# EAGLE design v0 (EAGLE 9.0.1)
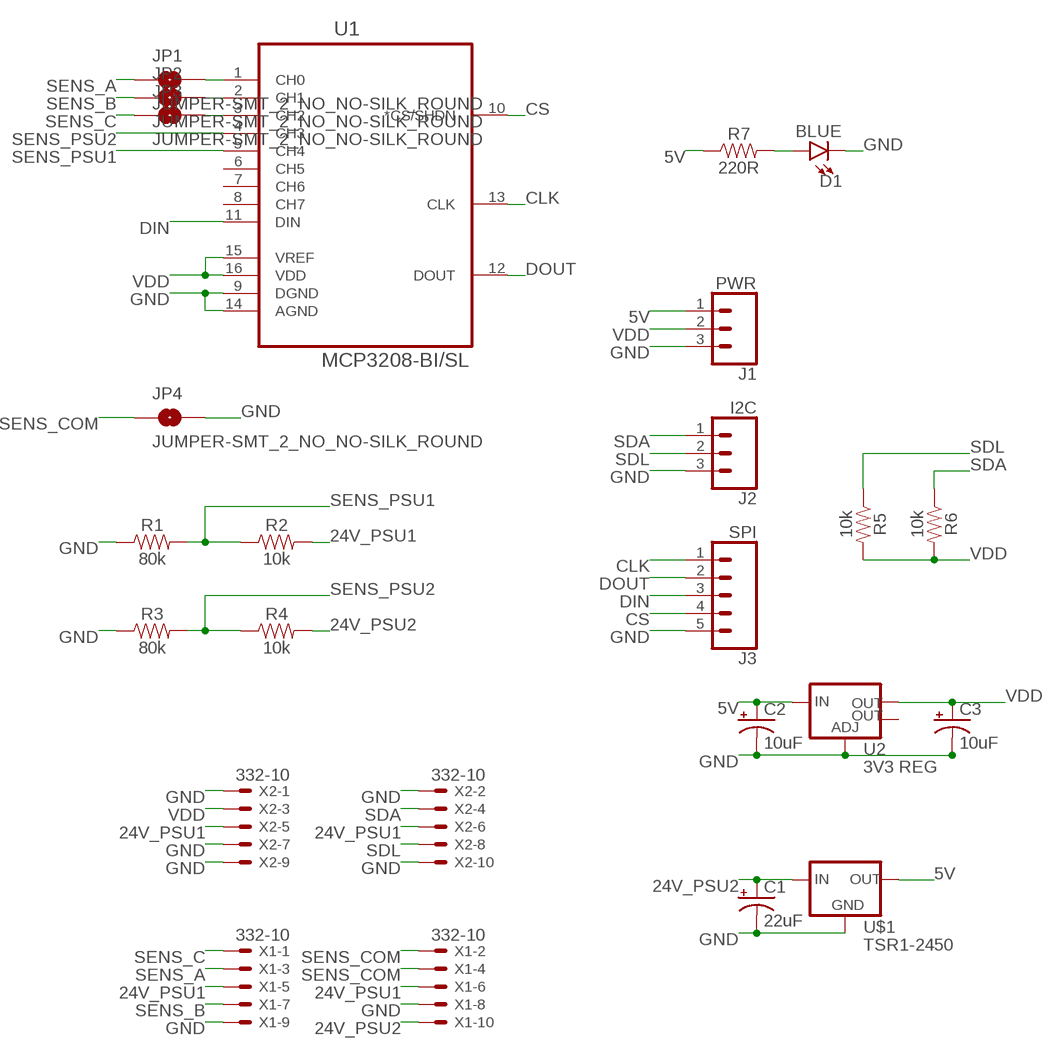
[diagram p0: schematic, sheet 1]

## Parts
C1  22uF  10UF-POLAR-EIA3216-16V-10%(TANT)  [EIA3216]
C2  10uF  10UF-POLAR-EIA3216-16V-10%(TANT)  [EIA3216]
C3  10uF  10UF-POLAR-EIA3216-16V-10%(TANT)  [EIA3216]
D1  BLUE  LED-BLUE0603  [LED-0603]
J1  PWR  CONN_03  [1X03]
J2  I2C  CONN_03  [1X03]
J3  SPI  CONN_05  [1X05]
JP1  JUMPER-SMT_2_NO_NO-SILK_ROUND  [SMT-JUMPER_2_NO_NO-SILK_ROUND]
JP2  JUMPER-SMT_2_NO_NO-SILK_ROUND  [SMT-JUMPER_2_NO_NO-SILK_ROUND]
JP3  JUMPER-SMT_2_NO_NO-SILK_ROUND  [SMT-JUMPER_2_NO_NO-SILK_ROUND]
JP4  JUMPER-SMT_2_NO_NO-SILK_ROUND  [SMT-JUMPER_2_NO_NO-SILK_ROUND]
R1  80k  RESISTOR0805  [0805]
R2  10k  RESISTOR0805  [0805]
R3  80k  RESISTOR0805  [0805]
R4  10k  RESISTOR0805  [0805]
R5  10k  RESISTOR0805  [0805]
R6  10k  RESISTOR0805  [0805]
R7  220R  RESISTOR0805  [0805]
U1  MCP3208-BI/SL  [SOIC127P600X175-16N]
U2  3V3 REG  V_REG_LM1117SOT223  [SOT223]
U$1  TSR1-2450  [TSR1-2450]
X1  332-10  [332-10]
X2  332-10  [332-10]

## Nets
5V: C2.+ J1.1 R7.1 U2.3(IN) U$1.3(OUT)
24V_PSU1: R2.2 X1.5 X1.6 X2.5 X2.6
24V_PSU2: C1.+ R4.2 U$1.1(IN) X1.10
CLK: J3.1 U1.13(CLK)
CS: J3.4 U1.10(*CS/SHDN)
DIN: J3.3 U1.11(DIN)
DOUT: J3.2 U1.12(DOUT)
GND: C1.- C2.- C3.- D1.C J1.3 J2.3 J3.5 JP4.2 R1.1 R3.1 U1.9(DGND) U1.14(AGND) U2.1(ADJ) U$1.2(GND) X1.8 X1.9 X2.1 X2.2 X2.7 X2.9 X2.10
N$1: JP1.2 U1.1(CH0)
N$2: JP2.2 U1.2(CH1)
N$3: JP3.2 U1.3(CH2)
N$4: D1.A R7.2
SDA: J2.1 R6.1 X2.4
SDL: J2.2 R5.1 X2.8
SENS_A: JP1.1 X1.3
SENS_B: JP2.1 X1.7
SENS_C: JP3.1 X1.1
SENS_COM: JP4.1 X1.2 X1.4
SENS_PSU1: R1.2 R2.1 U1.5(CH4)
SENS_PSU2: R3.2 R4.1 U1.4(CH3)
VDD: C3.+ J1.2 R5.2 R6.2 U1.15(VREF) U1.16(VDD) U2.2(OUT) X2.3
Unconnected: U1.6(CH5) U1.7(CH6) U1.8(CH7) U2.4(OUT)

## Library data of the parts
C1 = SparkFun-Capacitors:10UF-POLAR: 10.0µF polarized capacitors A capacitor is a passive two-terminal electrical component used to store electrical energy temporarily in an electric field.; PROD_ID: CAP-00811; VALUE: 10uF
C2 C3 = SparkFun-Capacitors:10UF-POLAR: 10.0µF polarized capacitors A capacitor is a passive two-terminal electrical component used to store electrical energy temporarily in an electric field.; PROD_ID: CAP-00811
D1 = SparkFun-LED:LED-BLUE: Blue SMD LED Used in manufacturing of various products at SparkFun Packages: 0603 - SMD 0603 package [Product Link] <http://www.digikey.com/product-detail/en/SMLE12BC7TT86/511-1589-2-ND/1641808> 1206 - SMD1206 package [Product Link] <http://www.digikey.com/product-detail/en/lite-on-inc/LTST-C150TBKT/160-1643-1-ND/573584> SparkFun Products: ESP8266 Thing-Dev Board <https://www.sparkfun.com/products/13711> RedBoard <https://www.sparkfun.com/products/12757>; PROD_ID: DIO-08575
J1 J2 = SparkFun-Connectors:CONN_03: Multi connection point. Often used as Generic Header-pin footprint for 0.1 inch spaced/style header connections On any of the 0.1 inch spaced packages, you can populate with these: Break Away Headers - Straight <https://www.sparkfun.com/products/116> (PRT-00116) Break Away Male Headers - Right Angle <https://www.sparkfun.com/products/553> (PRT-00553) Female Headers <https://www.sparkfun.com/products/115> (PRT-00115) Break Away Headers - Machine Pin <https://www.sparkfun.com/products/117> (PRT-00117) Break Away Female Headers - Swiss Machine Pin <https://www.sparkfun.com/products/743> (PRT-00743) Stackable Header - 3 Pin (Female, 0.1") <https://www.sparkfun.com/products/13875> (PRT-13875) For SCREWTERMINALS and SPRING TERMINALS visit here: Screw Terimnals on SparkFun.com <https://www.sparkfun.com/search/results?term=Screw+Terminals> (5mm/3.5mm/2.54mm spacing) This device is also useful as a general connection point to wire up your design to another part of your project. Our various solder wires solder well into these plated through hole pads. Hook-Up Wire - Assortment (Stranded, 22 AWG) <https://www.sparkfun.com/products/11375> (PRT-11375) Hook-Up Wire - Assortment (Solid Core, 22 AWG) <https://www.sparkfun.com/products/11367> (PRT-11367) View the entire wire category on our website here <https://www.sparkfun.com/categories/141> Special notes: Molex polarized connector foot print use with SKU : PRT-08232 with associated crimp pins and housings.
J3 = SparkFun-Connectors:CONN_05: Multi connection point. Often used as Generic Header-pin footprint for 0.1 inch spaced/style header connections On any of the 0.1 inch spaced packages, you can populate with these: Break Away Headers - Straight <https://www.sparkfun.com/products/116> (PRT-00116) Break Away Male Headers - Right Angle <https://www.sparkfun.com/products/553> (PRT-00553) Female Headers <https://www.sparkfun.com/products/115> (PRT-00115) Break Away Headers - Machine Pin <https://www.sparkfun.com/products/117> (PRT-00117) Break Away Female Headers - Swiss Machine Pin <https://www.sparkfun.com/products/743> (PRT-00743) For SCREWTERMINALS and SPRING TERMINALS visit here: Screw Terimnals on SparkFun.com <https://www.sparkfun.com/search/results?term=Screw+Terminals> (5mm/3.5mm/2.54mm spacing) This device is also useful as a general connection point to wire up your design to another part of your project. Our various solder wires solder well into these plated through hole pads. Hook-Up Wire - Assortment (Stranded, 22 AWG) <https://www.sparkfun.com/products/11375> (PRT-11375) Hook-Up Wire - Assortment (Solid Core, 22 AWG) <https://www.sparkfun.com/products/11367> (PRT-11367) View the entire wire category on our website here <https://www.sparkfun.com/categories/141> Special notes: Molex polarized connector foot print use with SKU : PRT-08231 with associated crimp pins and housings. 1MM SMD Version SKU: PRT-10208
JP1-JP4 = SparkFun-Jumpers:JUMPER-SMT_2_NO: Normally open jumper This jumper has two pads in close proximity to each other. Apply solder to close the connection. Round pads are easier to solder for beginners, but are a lot larger. SparkFun Product that uses the round pads: SparkFun EL Sequencer <https://www.sparkfun.com/products/12781>
R1-R7 = SparkFun-Resistors:RESISTOR: Generic Resistor Package
U1 = MCP3208-BI_SL:MCP3208-BI/SL: IC, 12 ADC, SMD, 3208; AVAILABILITY: Good; DESCRIPTION: Octal Channel Single ADC SAR 100ksps 12-bit Serial Automotive 16-Pin SOIC N Tube; MF: Microchip; MP: MCP3208-BI/SL; PACKAGE: SOIC-16 Microchip; PRICE: 3.99 USD
U2 = SparkFun-IC-Power:V_REG_LM1117: Voltage Regulator LM1117 Standard adjustable voltage regulator but in SMD form. Spark Fun Electronics SKU : COM-00595; PROD_ID: VREG-08170
U$1 = TSR1-2450:TSR1-2450; AVAILABILITY: Good; DESCRIPTION: Converter: DC/DC; Uin: 6.5÷36V; 5VDC; Iout: 1A; SIP3; Eff; MF: Tracopower; MP: TSR 1-2450; PACKAGE: SIP-3 Tracopower; PRICE: 6.18 USD
X1 X2 = con-garry:332-10: 10 Pin - 2mm Dual Row Source: www.mpe-connector.de / garry_shortform_2012.pdf

## Board
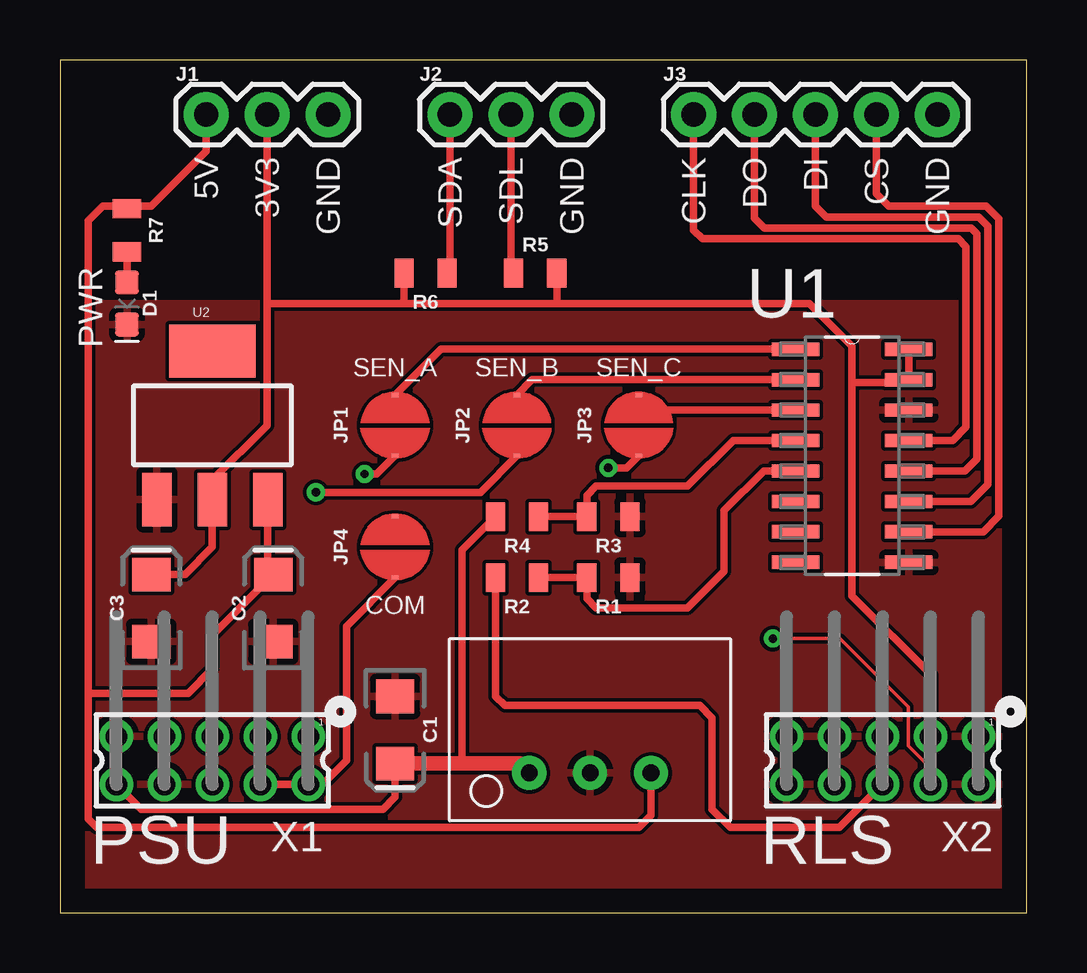
[diagram p1: board, top side]
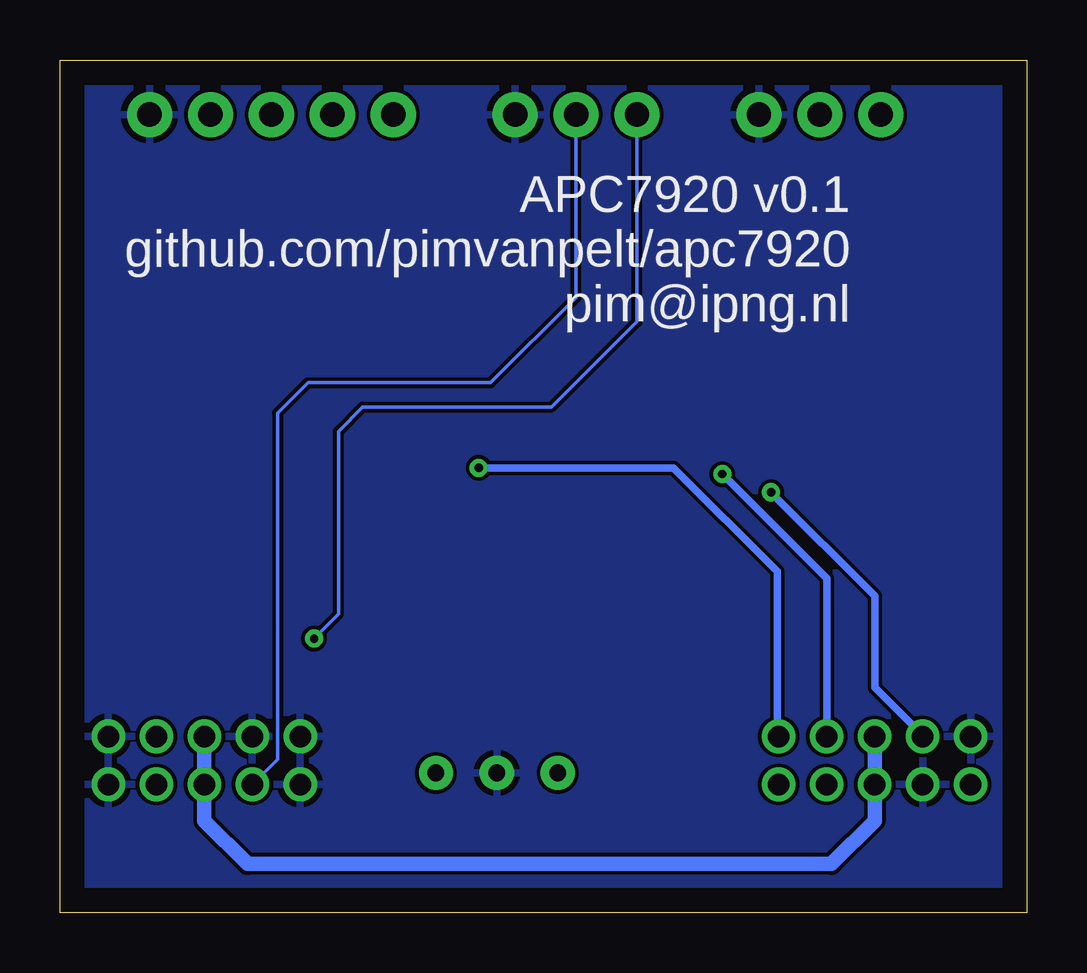
[diagram p2: board, bottom side, seen from below]

Size 40.31 x 35.55 mm. Coordinates in mm from the lower left corner, seen from the top.
Outline: 0,0 40.31,0 40.31,35.55 0,35.55 0,0
Copper layers (1*16): Top 0.035mm / dielectric 1.5mm / Bottom 0.035mm
Design rules "default": minimum track width 6mil, minimum drill 0.35mm, track to track 6mil, track to pad 6mil, pad to pad 6mil, via to via 6mil, smd to smd 6mil, copper to edge 40mil, drill to drill 6mil, minimum pad ring 10mil, minimum via ring 8mil, stop-mask expansion 4mil, vias tented up to drill 0mil, thermal gap 10mil

### Footprints (pad centres in the part's own frame; a part is rotated, then mirrored left to right if it is on the bottom)
EIA3216 = smd 1.4 x 1.6: + 1.4,0; - -1.4,0
LED-0603 = smd 1 x 1: A -0.877,0; C 0.877,0
1X03 = drill 1.016 pad 1.88: 1 0,0; 2 2.54,0; 3 5.08,0
1X05 = drill 1.016 pad 1.88: 1 0,0; 2 2.54,0; 3 5.08,0; 4 7.62,0; 5 10.16,0
SMT-JUMPER_2_NO_NO-SILK_ROUND = smd 0.152 x 0.305: 1 -1.27,0; 2 1.27,0
0805 = smd 0.8 x 1.2: 1 -0.9,0; 2 0.9,0
SOIC127P600X175-16N = smd 1.981 x 0.559: 1 -2.362,4.445; 2 -2.362,3.175; 3 -2.362,1.905; 4 -2.362,0.635; 5 -2.362,-0.635; 6 -2.362,-1.905; 7 -2.362,-3.175; 8 -2.362,-4.445; 9 2.362,-4.445; 10 2.362,-3.175; 11 2.362,-1.905; 12 2.362,-0.635; 13 2.362,0.635; 14 2.362,1.905; 15 2.362,3.175; 16 2.362,4.445
SOT223 = smd 1.219 x 2.235: 1 -2.311,-3.099; 2 0,-3.099; 3 2.311,-3.099 | smd 3.6 x 2.2: 4 0,3.099
TSR1-2450 = drill 0.7 pad 1.422: 1 3.05,2.02; 2 5.59,2.02; 3 8.13,2.02
332-10 = drill 0.9 pad 1.27: 1 -4,-1; 2 -4,1; 3 -2,-1; 4 -2,1; 5 0,-1; 6 0,1; 7 2,-1; 8 2,1; 9 4,-1; 10 4,1

### Placement (x,y rotation side)
C1  13.97,7.62 270 top
C2  8.89,12.7 90 top
C3  3.81,12.7 90 top
D1  2.79,25.4 270 top
J1  6.1,33.27 0 top
J2  16.26,33.27 0 top
J3  26.42,33.27 0 top
JP1  13.97,20.32 90 top
JP2  19.05,20.32 90 top
JP3  24.13,20.32 90 top
JP4  13.97,15.24 90 top
R1  22.86,13.97 180 top
R2  19.05,13.97 180 top
R3  22.86,16.51 180 top
R4  19.05,16.51 180 top
R5  19.81,26.67 0 top
R6  15.24,26.67 180 top
R7  2.79,28.45 270 top
U1  33.02,19.05 0 top
U2  6.35,20.32 0 top
U$1  16.51,3.81 0 top
X1  6.35,6.35 180 top
X2  34.29,6.35 180 top

### Tracks (layer width: path | path; a pad name or v marks a point on that pad's centre or on a via)
5V
  Top 0.305: U2.3 8.66,14.33 C2.+ 6.35,11.56 6.35,10.16 5.33,9.14 1.17,9.14 | U$1.3 24.64,4.06 24.13,3.56 1.52,3.56 1.17,3.91 1.17,9.14 | 1.17,9.14 1.17,28.85 1.78,29.46 2.68,29.46 | 2.68,29.46 R7.1 | J1.1 6.1,31.75 3.81,29.46 2.68,29.46
24V_PSU1
  Top 0.305: R2.2 18.15,9.03 18.54,8.64 26.67,8.64 27.18,8.13 27.18,4.32 27.94,3.56 32.5,3.56 X2.6
  Bottom 0.61: X2.5 X2.6 34.29,3.83 32.5,2.03 8.14,2.03 6.35,3.83 X1.6 X1.5
24V_PSU2
  Top 0.305: R4.2 16.76,15.12 16.76,6.22 | X1.10 3.38,4.32 13.46,4.32 13.97,4.83 C1.+
  Top 0.61: C1.+ 16.76,6.22 19.17,6.22 U$1.1
CLK
  Top 0.305: U1.13 37.21,19.68 37.77,20.24 37.77,27.76 37.44,28.09 26.77,28.09 26.42,28.45 J3.1
CS
  Top 0.305: U1.10 38.48,15.88 39.14,16.54 39.14,28.93 38.61,29.46 34.54,29.46 34.04,29.97 J3.4
DIN
  Top 0.305: U1.11 37.97,17.14 38.68,17.86 38.68,28.63 38.3,29.01 31.95,29.01 31.5,29.46 J3.3
DOUT
  Top 0.305: U1.12 37.72,18.41 38.23,18.92 38.23,28.32 38,28.55 29.36,28.55 28.96,28.96 J3.2
GND
  pour Top: 0,25.4 40.39,25.4 40.39,0 0,0
  pour Bottom: 0,35.31 40.39,35.31 40.39,0.25 0,0.25
N$1
  Top 0.305: U1.1 15.88,23.5 JP1.2
N$2
  Top 0.305: U1.2 19.68,22.23 JP2.2
N$3
  Top 0.305: U1.3 24.77,20.95 JP3.2
N$4
  Top 0.305: R7.2 D1.A
SDA  (via drill 0.35)
  Top 0.152: X2.4 36.29,6.03 35.36,6.96 35.36,8.59 32.51,11.43 v29.72,11.43
  Top 0.305: J2.1 16.26,26.79 R6.1
  Bottom 0.152: v29.72,11.43 28.7,12.45 28.7,20.07 27.69,21.08 19.81,21.08 16.26,24.64 J2.1
SDL
  Top 0.305: J2.2 18.8,26.79 R5.1
  Bottom 0.152: X2.8 31.24,6.4 31.24,20.83 29.97,22.1 22.35,22.1 18.8,25.65 J2.2
SENS_A  (via drill 0.35)
  Top 0.305: JP1.1 13.21,18.29 v12.7,18.29
  Bottom 0.305: v12.7,18.29 8.35,13.94 X1.3
SENS_B  (via drill 0.35)
  Top 0.305: JP2.1 17.53,17.53 v10.67,17.53
  Bottom 0.305: v10.67,17.53 6.35,13.21 6.35,9.4 4.35,7.4 X1.7
SENS_C  (via drill 0.35)
  Top 0.305: JP3.1 23.62,18.54 v22.86,18.54
  Bottom 0.305: X1.1 10.41,7.41 10.41,14.22 14.73,18.54 v22.86,18.54
SENS_COM
  Top 0.305: X1.4 X1.2 10.94,5.35 11.94,6.35 11.94,11.94 JP4.1
SENS_PSU1
  Top 0.305: R2.1 R1.2 21.96,13.09 22.35,12.7 26.16,12.7 27.69,14.22 27.69,16.76 29.34,18.41 U1.5
SENS_PSU2
  Top 0.305: R4.1 R3.2 21.96,17.39 22.35,17.78 26.16,17.78 28.07,19.68 U1.4
VDD
  Top 0.305: U1.16 U1.15 35.26,22.1 33.02,22.1 | C3.+ 5.21,14.1 6.35,15.24 U2.2 6.35,18.03 8.64,20.32 8.64,25.4 | 33.02,22.1 33.02,23.62 31.24,25.4 20.83,25.4 | 33.02,22.1 33.02,13.21 36.32,9.91 36.32,7.38 X2.3 | J1.2 8.64,25.4 | 20.83,25.4 14.22,25.4 | 14.22,25.4 8.64,25.4 | R6.2 14.34,25.52 14.22,25.4 | R5.2 20.71,25.52 20.83,25.4

### Text on the board
tPlace: 5V | 3V3 | GND | SDA | SDL | GND | CLK | DO | DI | CS | GND | PWR | SEN_A | SEN_B | SEN_C | COM | PSU | RLS
bPlace: APC7920 v0.1 / github.com/pimvanpelt/apc7920 / pim@ipng.nl